# Altium schematic sheet DeltaSigma12.SchDoc: LiveDesign Evaluation - Wave Player
size A; Organization: Altium Limited; Address1: L3, 12a Rodborough Rd; Address2: Frenchs Forest; Address3: NSW; Address4: Australia 2086; DocumentNumber: 2; SheetNumber: 2; SheetTotal: 4
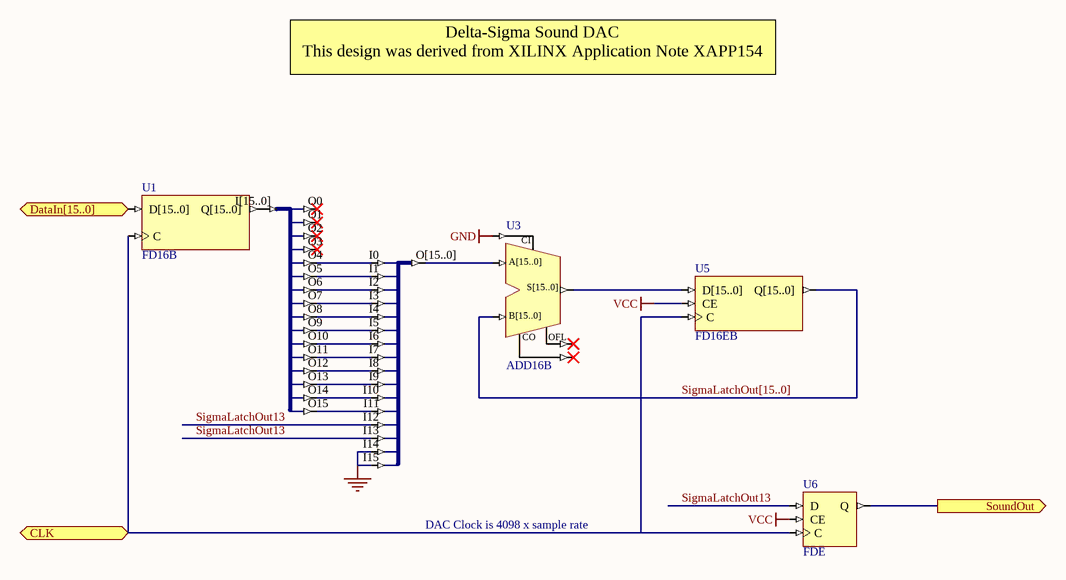
[diagram p0: DeltaSigma12.SchDoc]

## Parts
U1  FD16B
U2  J16B_16S  (value not drawn)
U3  ADD16B
U4  J16S_16B  (value not drawn)
U5  FD16EB
U6  FDE

## Ports
CLK (in), DataIn[15..0] (in), SoundOut (out)

## Nets
GND: U3.CI U4.I14 U4.I15
VCC: U5.CE U6.CE
CLK: U1.C U5.C U6.C ; port CLK
DataIn[15..0]: U1.D[15..0] ; port DataIn[15..0]
SigmaLatchOut13: U4.I12 U4.I13 U6.D
SigmaLatchOut[15..0]: U3.B[15..0] U5.Q[15..0]
SoundOut: U6.Q ; port SoundOut
NetU1_Q[15..0]: U1.Q[15..0] U2.I[15..0]
NetU2_O4: U2.O4 U4.I0
NetU2_O5: U2.O5 U4.I1
NetU2_O6: U2.O6 U4.I2
NetU2_O7: U2.O7 U4.I3
NetU2_O8: U2.O8 U4.I4
NetU2_O9: U2.O9 U4.I5
NetU2_O10: U2.O10 U4.I6
NetU2_O11: U2.O11 U4.I7
NetU2_O12: U2.O12 U4.I8
NetU2_O13: U2.O13 U4.I9
NetU2_O14: U2.O14 U4.I10
NetU2_O15: U2.O15 U4.I11
NetU3_A[15..0]: U3.A[15..0] U4.O[15..0]
NetU3_S[15..0]: U3.S[15..0] U5.D[15..0]

Not connected (* = marked no-connect by the designer): U2 O0* O1* O2* O3*; U3 CO* OFL*

## Buses and harness runs
bus SigmaLatchOut[15..0]

## Notes on the sheet
- Delta-Sigma Sound DAC
  This design was derived from XILINX Application Note XAPP154
- DAC Clock is 4098 x sample rate
- Title
- Size:
- Date:
- A
- Number:
- Time:
- Revision:
- Sheet
- of
- File:

## Library data of the parts
U1 = FD16B: 16-Bit D-Type Flip-Flop, Bus Version; SubClass: FD; ClockTrigger: Rising; PortSize: 16; ArchiveName: GENERIC; VHDLIB_SIM: GENERIC_LIB; Published: 29-Jan-2004; Publisher: Altium Limited; LastRevisionNo: 1.00.00; HelpURL: CR0118 FPGA Generic Library Guide.pdf#page=169; ComponentLink1URL: CR0133 FPGA Flip Flop Resource Usage.pdf#page=101; ComponentLink1Description: Core &Resource Usage; FunctionalClass: Flip-Flop; PortStyle: Bus Version
U2 = J16B_16S: Single 16-Bit input bus to 16 single pin outputs; ArchiveName: GENERIC; VHDLIB_SIM: GENERIC_LIB; FunctionalClass: Bus Joiner; PortSize: 16; Published: 29-Jan-2004; Publisher: Altium Limited; ComponentLink1Description: Core &Resource Usage; ComponentLink1URL: CR0126 FPGA Bus Joiner Resource Usage.pdf#page=44; HelpURL: CR0118 FPGA Generic Library Guide.pdf#page=303; LastRevisionNo: 1.00.00
U3 = ADD16B: 16-Bit Cascadable Full Adder with Signed and Unsigned Operations, Bus Version; ArchiveName: GENERIC; VHDLIB_SIM: GENERIC_LIB; FunctionalClass: Arithmetic Function; PortSize: 16; SubClass: ADD; XilinxEquivalent: ADD16; Published: 29-Jan-2004; Publisher: Altium Limited; ComponentLink1Description: Core &Resource Usage; ComponentLink1URL: CR0124 FPGA Arithmetic Function Resource Usage.pdf#page=17; HelpURL: CR0118 FPGA Generic Library Guide.pdf#page=98; LastRevisionNo: 1.00.00; PortStyle: Bus Version
U4 = J16S_16B: 16 Single pin inputs to single 16-Bit output bus; ArchiveName: GENERIC; VHDLIB_SIM: GENERIC_LIB; FunctionalClass: Bus Joiner; PortSize: 16; Published: 29-Jan-2004; Publisher: Altium Limited; ComponentLink1Description: Core &Resource Usage; ComponentLink1URL: CR0126 FPGA Bus Joiner Resource Usage.pdf#page=45; HelpURL: CR0118 FPGA Generic Library Guide.pdf#page=305; LastRevisionNo: 1.00.00
U5 = FD16EB: 16-Bit D Flip-Flop with Clock Enable, Bus Version; ArchiveName: GENERIC; VHDLIB_SIM: GENERIC_LIB; ClockTrigger: Rising; Enable: High; PortSize: 16; SubClass: FD; Published: 29-Jan-2004; Publisher: Altium Limited; ComponentLink1Description: Core &Resource Usage; ComponentLink1URL: CR0133 FPGA Flip Flop Resource Usage.pdf#page=110; FunctionalClass: Flip-Flop; HelpURL: CR0118 FPGA Generic Library Guide.pdf#page=186; LastRevisionNo: 1.00.00; PortStyle: Bus Version
U6 = FDE: D Flip-Flop with Clock Enable; ArchiveName: GENERIC; VHDLIB_SIM: GENERIC_LIB; ClockTrigger: Rising; Enable: High; SubClass: FD; Published: 29-Jan-2004; Publisher: Altium Limited; ComponentLink1Description: Core &Resource Usage; ComponentLink1URL: CR0133 FPGA Flip Flop Resource Usage.pdf#page=162; FunctionalClass: Flip-Flop; HelpURL: CR0118 FPGA Generic Library Guide.pdf#page=186; LastRevisionNo: 1.00.00